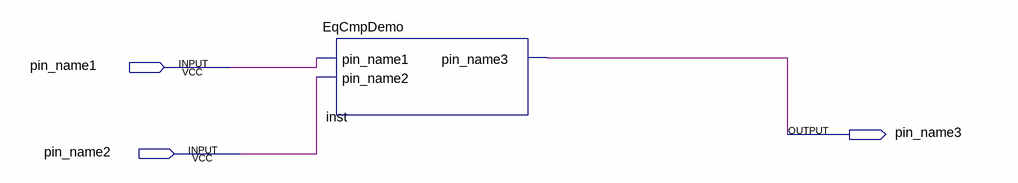
[diagram p0: schematic sheet]
// Quartus schematic Block2.bdf as structural Verilog: 1 symbols, 3 pins
module Block2 (
  input  pin_name1,
  input  pin_name2,
  output pin_name3
);

  EqCmpDemo inst (.pin_name1(pin_name1), .pin_name2(pin_name2), .pin_name3(pin_name3));
endmodule
